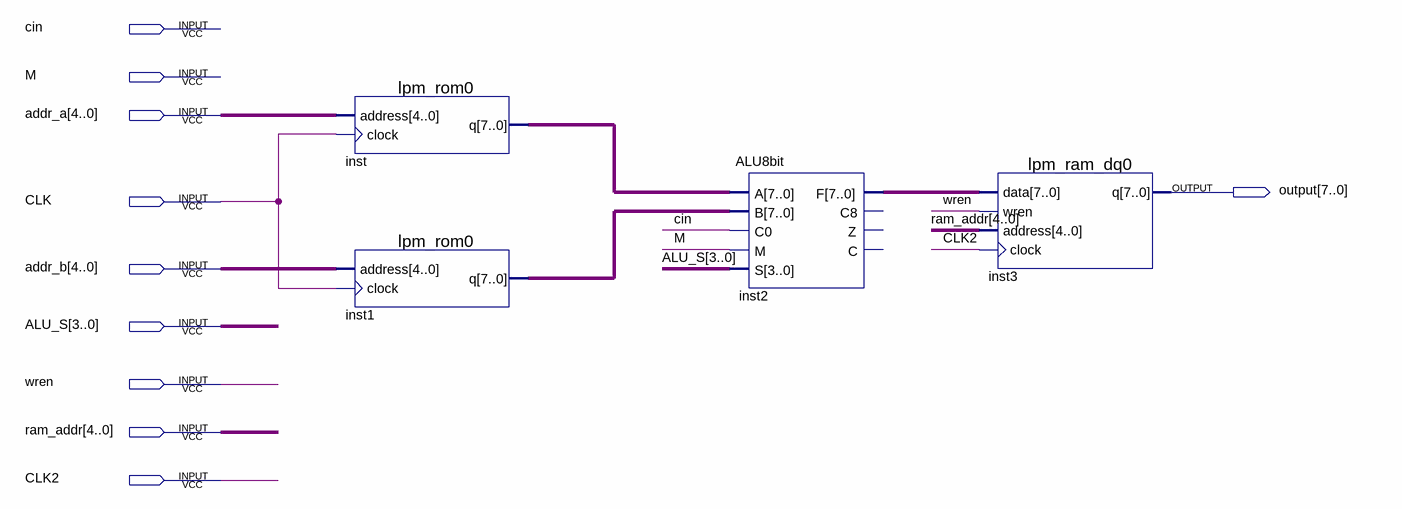
[diagram p0: schematic sheet]
// Quartus schematic check.bdf as structural Verilog: 4 symbols, 10 pins
module check (
  input  cin,
  input  M,
  input  [4:0] addr_a,
  input  CLK,
  input  [4:0] addr_b,
  input  [3:0] ALU_S,
  input  wren,
  input  [4:0] ram_addr,
  input  CLK2,
  output [7:0] \output 
);

  wire [7:0] inst1_q, inst2_f, inst_q;

  lpm_rom0 inst (.address(addr_a), .clock(CLK), .q(inst_q));
  lpm_rom0 inst1 (.address(addr_b), .clock(CLK), .q(inst1_q));
  ALU8bit inst2 (.A(inst_q), .B(inst1_q), .C0(cin), .M(M), .S(ALU_S), .F(inst2_f));  // open: C8, Z, C
  lpm_ram_dq0 inst3 (.data(inst2_f), .wren(wren), .address(ram_addr), .clock(CLK2), .q(\output ));
endmodule
